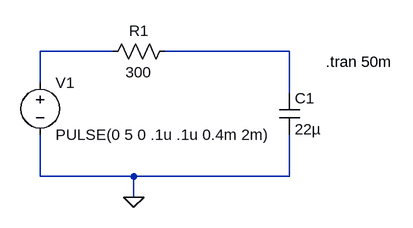
[diagram p0: schematic triangle.asc]
triangle.asc, the LTspice schematic file:
Version 4
SHEET 1 880 680
WIRE 128 240 16 240
WIRE 400 240 208 240
WIRE 16 288 16 240
WIRE 400 304 400 240
WIRE 16 432 16 368
WIRE 160 432 16 432
WIRE 400 432 400 368
WIRE 400 432 160 432
WIRE 160 464 160 432
FLAG 160 464 0
SYMBOL voltage 16 272 R0
SYMATTR InstName V1
SYMATTR Value PULSE(0 5 0 .1u .1u 0.4m 2m)
SYMBOL res 224 224 R90
WINDOW 0 0 56 VBottom 2
WINDOW 3 32 56 VTop 2
SYMATTR InstName R1
SYMATTR Value 300
SYMBOL cap 384 304 R0
SYMATTR InstName C1
SYMATTR Value 22µ
SYMATTR SpiceLine Rser=0 Lser=0
TEXT 456 256 Left 2 !.tran 50m

The netlist it stands for:
* triangle.asc
V1 N001 0 PULSE(0 5 0 .1u .1u 0.4m 2m)
R1 N002 N001 300
C1 N002 0 22µ Rser=0 Lser=0
.tran 50m
.backanno
.end